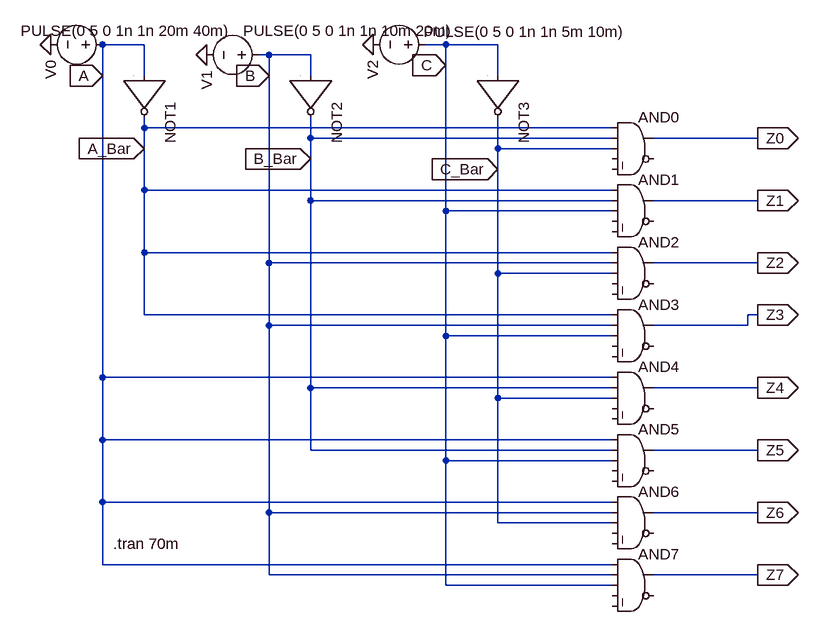
[diagram p0: schematic 3-8Decoder.asc]
3-8Decoder.asc, the LTspice schematic file:
Version 4.1
SHEET 1 1256 1360
WIRE 96 96 32 96
WIRE 560 96 528 96
WIRE 640 96 560 96
WIRE 288 112 272 112
WIRE 352 112 288 112
WIRE 560 128 560 96
WIRE 32 144 32 96
WIRE 96 144 96 96
WIRE 288 144 288 112
WIRE 352 144 352 112
WIRE 640 144 640 96
WIRE 96 224 96 208
WIRE 816 224 96 224
WIRE 352 240 352 208
WIRE 816 240 352 240
WIRE 1040 240 880 240
WIRE 96 256 96 224
WIRE 640 256 640 208
WIRE 816 256 640 256
WIRE 352 272 352 240
WIRE 640 288 640 256
WIRE 96 320 96 256
WIRE 816 320 96 320
WIRE 352 336 352 272
WIRE 816 336 352 336
WIRE 1040 336 880 336
WIRE 560 352 560 128
WIRE 816 352 560 352
WIRE 96 416 96 320
WIRE 816 416 96 416
WIRE 288 432 288 144
WIRE 816 432 288 432
WIRE 1040 432 880 432
WIRE 640 448 640 288
WIRE 816 448 640 448
WIRE 96 512 96 416
WIRE 816 512 96 512
WIRE 1040 512 1024 512
WIRE 288 528 288 432
WIRE 816 528 288 528
WIRE 1024 528 1024 512
WIRE 1024 528 880 528
WIRE 560 544 560 352
WIRE 816 544 560 544
WIRE 32 608 32 144
WIRE 816 608 32 608
WIRE 352 624 352 336
WIRE 816 624 352 624
WIRE 1040 624 880 624
WIRE 640 640 640 448
WIRE 816 640 640 640
WIRE 32 704 32 608
WIRE 816 704 32 704
WIRE 352 720 352 624
WIRE 816 720 352 720
WIRE 1040 720 880 720
WIRE 560 736 560 544
WIRE 816 736 560 736
WIRE 32 800 32 704
WIRE 816 800 32 800
WIRE 288 816 288 528
WIRE 816 816 288 816
WIRE 1040 816 880 816
WIRE 640 832 640 640
WIRE 816 832 640 832
WIRE 32 896 32 800
WIRE 816 896 32 896
WIRE 288 912 288 816
WIRE 816 912 288 912
WIRE 1040 912 880 912
WIRE 560 928 560 736
WIRE 816 928 560 928
FLAG -48 96 0
FLAG 192 112 0
FLAG 448 96 0
FLAG 1040 240 Z0
IOPIN 1040 240 Out
FLAG 1040 336 Z1
IOPIN 1040 336 Out
FLAG 1040 432 Z2
IOPIN 1040 432 Out
FLAG 1040 512 Z3
IOPIN 1040 512 Out
FLAG 1040 624 Z4
IOPIN 1040 624 Out
FLAG 1040 720 Z5
IOPIN 1040 720 Out
FLAG 1040 816 Z6
IOPIN 1040 816 Out
FLAG 1040 912 Z7
IOPIN 1040 912 Out
FLAG 32 144 A
IOPIN 32 144 In
FLAG 288 144 B
IOPIN 288 144 In
FLAG 560 128 C
IOPIN 560 128 In
FLAG 96 256 A_Bar
IOPIN 96 256 In
FLAG 352 272 B_Bar
IOPIN 352 272 In
FLAG 640 288 C_Bar
IOPIN 640 288 In
SYMBOL voltage 48 96 R90
WINDOW 0 24 96 Left 2
WINDOW 3 -21 -182 VRight 2
WINDOW 123 0 0 Left 0
WINDOW 39 0 0 Left 0
SYMATTR InstName V0
SYMATTR Value PULSE(0 5 0 1n 1n 20m 40m)
SYMBOL voltage 288 112 R90
WINDOW 0 24 96 Left 2
WINDOW 3 -37 40 VLeft 2
WINDOW 123 0 0 Left 0
WINDOW 39 0 0 Left 0
SYMATTR InstName V1
SYMATTR Value PULSE(0 5 0 1n 1n 10m 20m)
SYMBOL voltage 544 96 R90
WINDOW 0 24 96 Left 2
WINDOW 3 -20 18 VLeft 2
WINDOW 123 0 0 Left 0
WINDOW 39 0 0 Left 0
SYMATTR InstName V2
SYMATTR Value PULSE(0 5 0 1n 1n 5m 10m)
SYMBOL Digital\\inv 160 144 R90
SYMATTR InstName NOT1
SYMBOL Digital\\inv 416 144 R90
SYMATTR InstName NOT2
SYMBOL Digital\\inv 704 144 R90
SYMATTR InstName NOT3
SYMBOL Digital\\and 848 192 R0
SYMATTR InstName AND0
SYMBOL Digital\\and 848 288 R0
SYMATTR InstName AND1
SYMBOL Digital\\and 848 384 R0
SYMATTR InstName AND2
SYMBOL Digital\\and 848 480 R0
SYMATTR InstName AND3
SYMBOL Digital\\and 848 576 R0
SYMATTR InstName AND4
SYMBOL Digital\\and 848 672 R0
SYMATTR InstName AND5
SYMBOL Digital\\and 848 768 R0
SYMATTR InstName AND6
SYMBOL Digital\\and 848 864 R0
SYMATTR InstName AND7
TEXT 48 864 Left 2 !.tran 70m

The netlist it stands for:
* 3-8Decoder.asc
V0 A 0 PULSE(0 5 0 1n 1n 20m 40m)
V1 B 0 PULSE(0 5 0 1n 1n 10m 20m)
V2 C 0 PULSE(0 5 0 1n 1n 5m 10m)
A§NOT1 A 0 0 0 0 A_Bar 0 0 BUF
A§NOT2 B 0 0 0 0 B_Bar 0 0 BUF
A§NOT3 C 0 0 0 0 C_Bar 0 0 BUF
AND0 A_Bar B_Bar C_Bar 0 0 0 Z0 0 AND
AND1 A_Bar B_Bar C 0 0 0 Z1 0 AND
AND2 A_Bar B C_Bar 0 0 0 Z2 0 AND
AND3 A_Bar B C 0 0 0 Z3 0 AND
AND4 A B_Bar C_Bar 0 0 0 Z4 0 AND
AND5 A B_Bar C 0 0 0 Z5 0 AND
AND6 A B C_Bar 0 0 0 Z6 0 AND
AND7 A B C 0 0 0 Z7 0 AND
.tran 70m
.backanno
.end